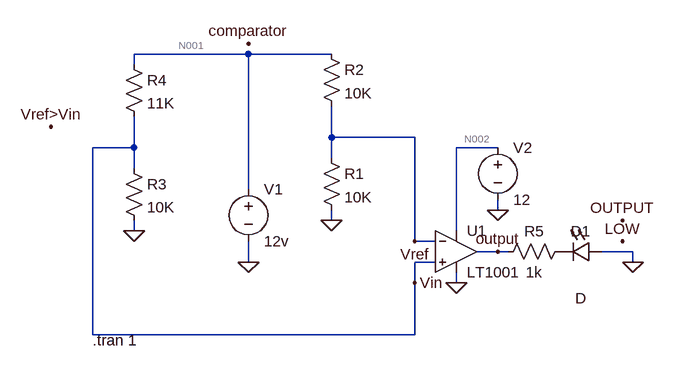
[diagram p0: schematic LTSPICE_Comparator.asc]
LTSPICE_Comparator.asc, the LTspice schematic file:
Version 4.1
SHEET 1 880 680
WIRE -176 -144 -352 -144
WIRE -48 -144 -176 -144
WIRE -352 -128 -352 -144
WIRE -48 -16 -48 -64
WIRE 80 -16 -48 -16
WIRE -352 0 -352 -48
WIRE -352 0 -416 0
WIRE 208 0 144 0
WIRE -48 16 -48 -16
WIRE -352 32 -352 0
WIRE -176 64 -176 -144
WIRE 208 96 208 80
WIRE -48 112 -48 96
WIRE -352 128 -352 112
WIRE 144 128 144 0
WIRE 80 144 80 -16
WIRE 112 144 80 144
WIRE 208 160 176 160
WIRE 224 160 208 160
WIRE 416 160 368 160
WIRE -176 176 -176 144
WIRE 112 176 80 176
WIRE 416 176 416 160
WIRE 80 208 80 176
WIRE 144 208 144 192
WIRE -416 288 -416 0
WIRE 80 288 80 208
WIRE 80 288 -416 288
FLAG -176 176 0
FLAG -48 112 0
FLAG -352 128 0
FLAG 144 208 0
FLAG 416 176 0
FLAG 208 96 0
FLAG 80 208 Vin
FLAG -176 -160 comparator
FLAG 208 160 output
FLAG 80 144 Vref
FLAG 400 112 OUTPUT
FLAG -480 -32 Vref>Vin
FLAG 400 144 LOW
SYMBOL OpAmps\\LT1001 144 96 R0
SYMATTR InstName U1
SYMBOL voltage -176 48 R0
WINDOW 123 0 0 Left 0
WINDOW 39 0 0 Left 0
SYMATTR InstName V1
SYMATTR Value 12v
SYMBOL res -64 0 R0
SYMATTR InstName R1
SYMATTR Value 10K
SYMATTR SpiceLine tol=1 pwr=0.1
SYMBOL res -64 -160 R0
SYMATTR InstName R2
SYMATTR Value 10K
SYMATTR SpiceLine tol=1 pwr=0.1
SYMBOL res -368 16 R0
SYMATTR InstName R3
SYMATTR Value 10K
SYMATTR SpiceLine tol=1 pwr=0.1
SYMBOL res -368 -144 R0
SYMATTR InstName R4
SYMATTR Value 11K
SYMATTR SpiceLine tol=1 pwr=0.1
SYMBOL res 320 144 R90
WINDOW 0 0 56 VBottom 2
WINDOW 3 32 56 VTop 2
SYMATTR InstName R5
SYMATTR Value 1k
SYMBOL LED 368 144 R90
WINDOW 0 0 32 VBottom 2
WINDOW 3 72 32 VTop 2
SYMATTR InstName D1
SYMBOL voltage 208 -16 R0
WINDOW 123 0 0 Left 0
WINDOW 39 0 0 Left 0
SYMATTR InstName V2
SYMATTR Value 12
TEXT -416 296 Left 2 !.tran 1

The netlist it stands for:
* LTSPICE_Comparator.asc
X§U1 Vin Vref N002 0 output LT1001  ; pins In+ In- V+ V- OUT
V1 N001 0 12v
R1 Vref 0 10K tol=1 pwr=0.1
R2 N001 Vref 10K tol=1 pwr=0.1
R3 Vin 0 10K tol=1 pwr=0.1
R4 N001 Vin 11K tol=1 pwr=0.1
R5 P001 output 1k
D1 0 P001 D
V2 N002 0 12
.model D D
.lib standard.dio
.tran 1
.lib LTC.lib
.backanno
.end

* Results of the author's LTspice run, read from the files saved beside the schematic
* Operating Point, zero values left out:
*   V(n001) = 12 V
*   V(n002) = 12 V
*   V(output) = 929.5 mV
*   V(p001) = 929.5 mV
*   V(vin) = 5.714 V
*   V(vref) = 6 V
*   I(R1) = 600 µA
*   I(R2) = 600 µA
*   I(R3) = 571.4 µA
*   I(R4) = 571.4 µA
*   I(V1) = -1.171 mA
*   I(V2) = -2.254 mA
*   Ix(u1:1) = -3.857 nA
*   Ix(u1:2) = 3.857 nA
*   Ix(u1:3) = 2.254 mA
*   Ix(u1:4) = -2.247 mA
*   Ix(u1:5) = 9.201 pA